# EAGLE design esp32-driver (EAGLE 9.6.2)
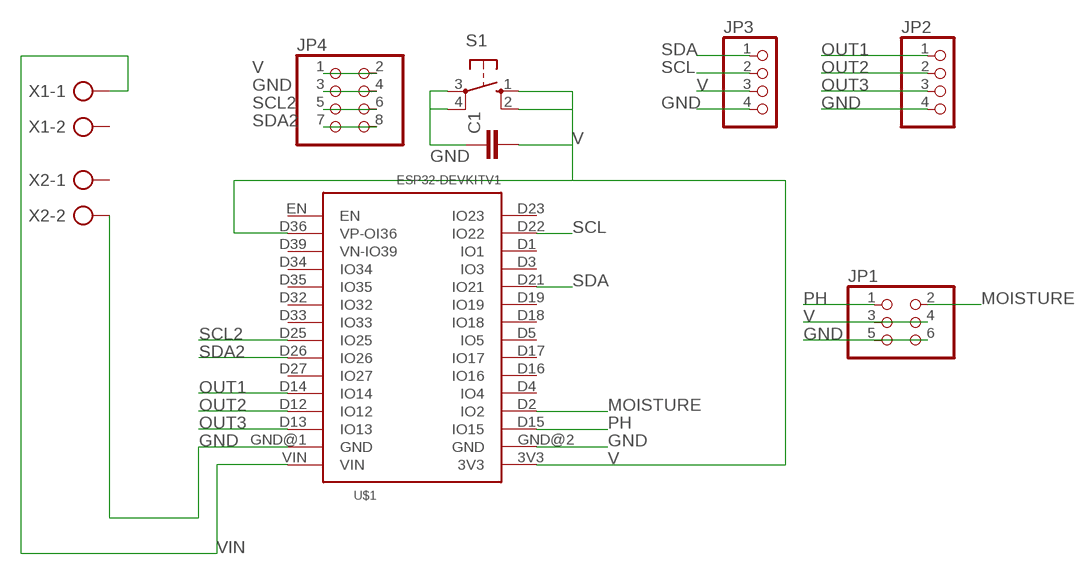
[diagram p0: schematic, sheet 1]

## Parts
C1  C-EU050-030X075  [C050-030X075]
JP1  PINHD-2X3  [2X03]
JP2  PINHD-1X4  [1X04]
JP3  PINHD-1X4  [1X04]
JP4  PINHD-2X4  [2X04]
S1  10-XX  [B3F-10XX]
U$1  ESP32DEVKITV1  [ESP32-DEVKITV1]
X1  AK300/2  [AK300/2]
X2  AK300/2  [AK300/2]

## Nets
GND: C1.1 JP1.5 JP1.6 JP2.4 JP3.4 JP4.3 JP4.4 S1.3(P) S1.4(P1) U$1.GND@1(GND) U$1.GND@2(GND) X2.2
MOISTURE: JP1.2 U$1.D2(IO2)
OUT1: JP2.1 U$1.D14(IO14)
OUT2: JP2.2 U$1.D12(IO12)
OUT3: JP2.3 U$1.D13(IO13)
PH: JP1.1 U$1.D15(IO15)
SCL: JP3.2 U$1.D22(IO22)
SCL2: JP4.5 JP4.6 U$1.D25(IO25)
SDA: JP3.1 U$1.D21(IO21)
SDA2: JP4.7 JP4.8 U$1.D26(IO26)
V: C1.2 JP1.3 JP1.4 JP3.3 JP4.1 JP4.2 S1.1(S) S1.2(S1) U$1.3V3 U$1.D36(VP-OI36)
VIN: U$1.VIN X1.1
Unconnected: U$1.D1(IO1) U$1.D3(IO3) U$1.D4(IO4) U$1.D5(IO5) U$1.D16(IO16) U$1.D17(IO17) U$1.D18(IO18) U$1.D19(IO19) U$1.D23(IO23) U$1.D27(IO27) U$1.D32(IO32) U$1.D33(IO33) U$1.D34(IO34) U$1.D35(IO35) U$1.D39(VN-IO39) U$1.EN X1.2 X2.1

## Library data of the parts
C1 = rcl:C-EU: CAPACITOR, European symbol; SPICEPREFIX: C
JP1 = pinhead:PINHD-2X3: PIN HEADER
JP2 JP3 = pinhead:PINHD-1X4: PIN HEADER
JP4 = pinhead:PINHD-2X4: PIN HEADER
S1 = switch-omron:10-XX: OMRON SWITCH; MPN: B3F-1000; OC_FARNELL: 176432; OC_NEWARK: 36M3542
U$1 = esp32-devkitv1:ESP32DEVKITV1
X1 X2 = con-ptr500:AK300/2: CONNECTOR; OC_FARNELL: unknown; OC_NEWARK: unknown

## Board
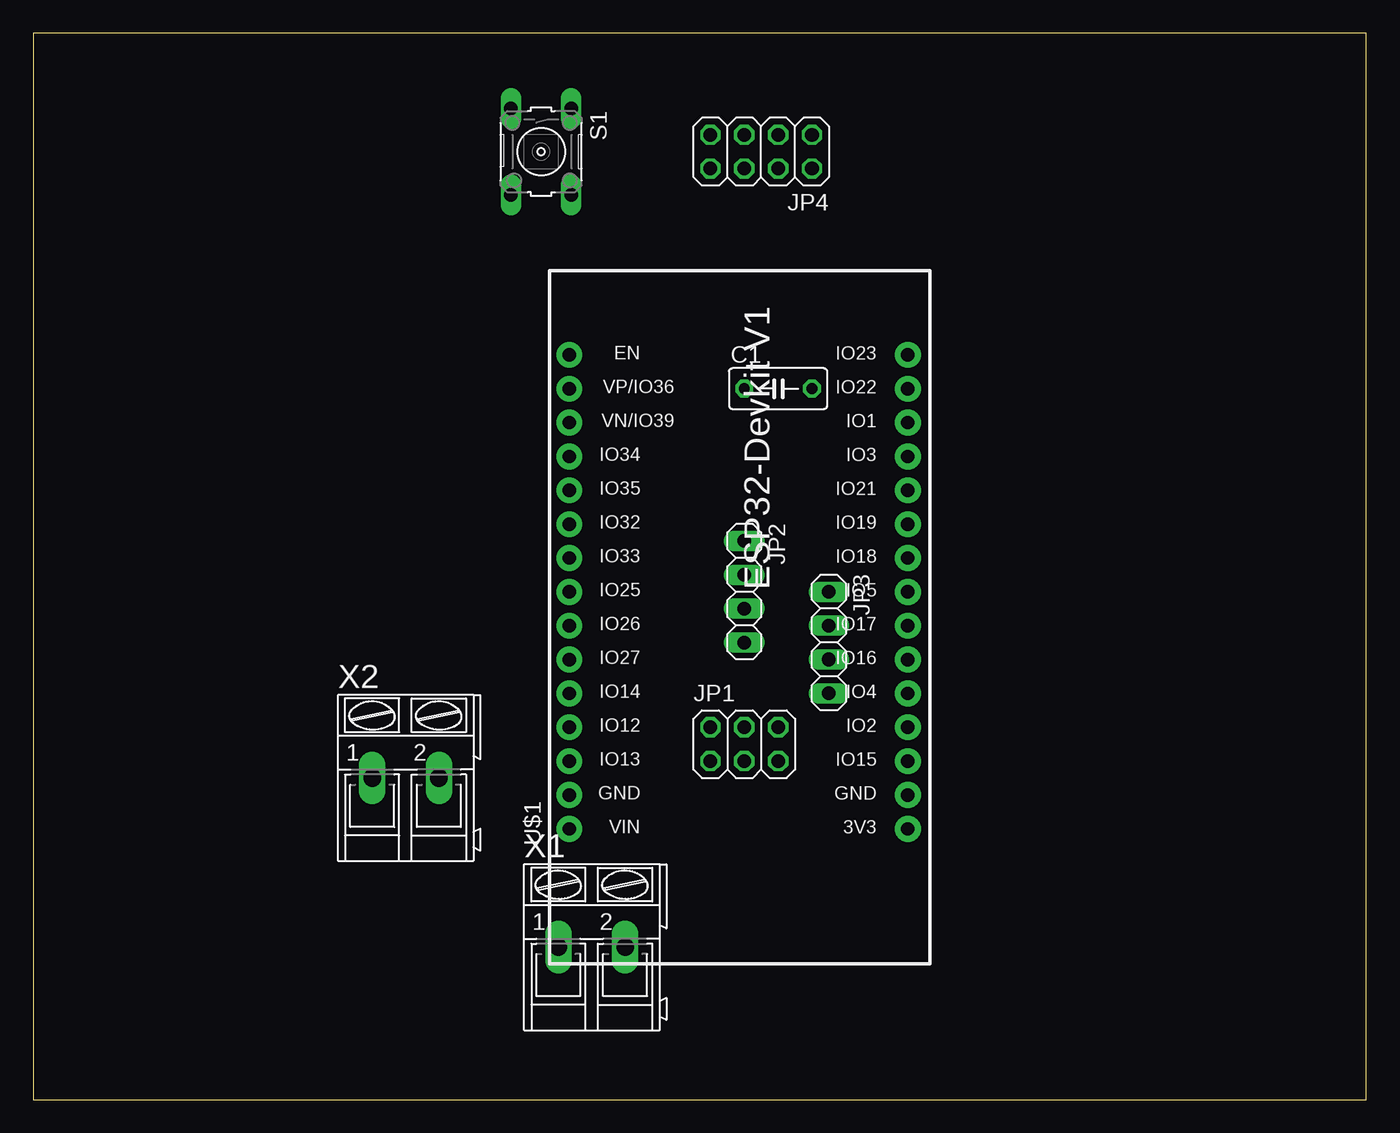
[diagram p1: board, top side]
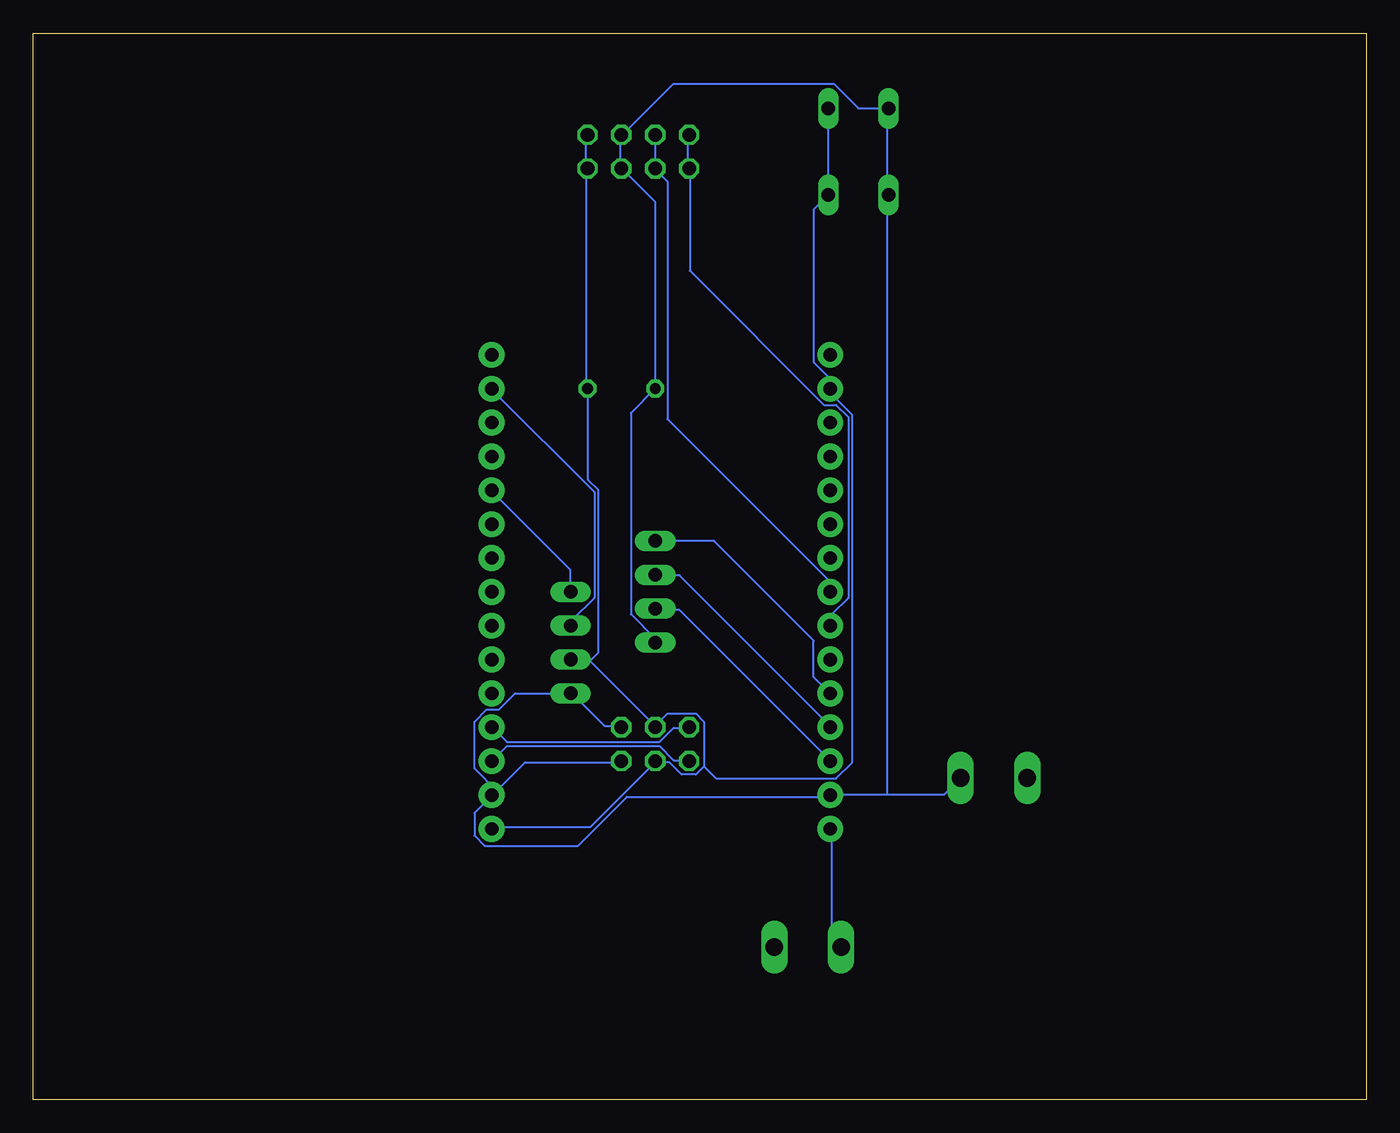
[diagram p2: board, bottom side, seen from below]

Size 100 x 80 mm. Coordinates in mm from the lower left corner, seen from the top.
Outline: 0,0 100,0 100,80 0,80 0,0
Copper layers (1*16): Top 0.035mm / dielectric 1.5mm / Bottom 0.035mm
Design rules "default": minimum track width 6mil, minimum drill 0.35mm, track to track 6mil, track to pad 6mil, pad to pad 6mil, via to via 6mil, smd to smd 6mil, copper to edge 40mil, drill to drill 6mil, minimum pad ring 10mil, minimum via ring 8mil, stop-mask expansion 4mil, vias tented up to drill 0mil, thermal gap 10mil

### Footprints (pad centres in the part's own frame; a part is rotated, then mirrored left to right if it is on the bottom)
C050-030X075 = drill 0.813 octagon: 1 -2.54,0; 2 2.54,0
2X03 = drill 1.016 octagon: 1 -2.54,-1.27; 2 -2.54,1.27; 3 0,-1.27; 4 0,1.27; 5 2.54,-1.27; 6 2.54,1.27
1X04 = drill 1.016 long: 1 -3.81,0; 2 -1.27,0; 3 1.27,0; 4 3.81,0
2X04 = drill 1.016 octagon: 1 -3.81,-1.27; 2 -3.81,1.27; 3 -1.27,-1.27; 4 -1.27,1.27; 5 1.27,-1.27; 6 1.27,1.27; 7 3.81,-1.27; 8 3.81,1.27
B3F-10XX = drill 1.016 long: 1 -3.251,2.261; 2 3.251,2.261; 3 -3.251,-2.261; 4 3.251,-2.261
ESP32-DEVKITV1 = drill 1 pad 1.93: 3V3 -16.52,-12.27; D1 13.96,-12.27; D2 -8.9,-12.27; D3 11.42,-12.27; D4 -6.36,-12.27; D5 1.26,-12.27; D12 -8.9,13.135; D13 -11.44,13.135; D14 -6.36,13.135; D15 -11.44,-12.27; D16 -3.82,-12.27; D17 -1.28,-12.27; D18 3.8,-12.27; D19 6.34,-12.27; D21 8.88,-12.27; D22 16.5,-12.27; D23 19.04,-12.27; D25 1.26,13.135; D26 -1.28,13.135; D27 -3.82,13.135; D32 6.34,13.135; D33 3.8,13.135; D34 11.42,13.135; D35 8.88,13.135; D36 16.5,13.135; D39 13.96,13.135; EN 19.04,13.135; GND@1 -13.98,13.135; GND@2 -13.98,-12.27; VIN -16.52,13.135
AK300/2 = drill 1.321 long: 1 -2.515,0; 2 2.489,0

### Placement (x,y rotation side)
C1  55.88,53.34 0 top
JP1  53.34,26.67 0 top
JP2  53.34,38.1 270 top
JP3  59.69,34.29 270 top
JP4  54.61,71.12 180 top
S1  38.1,71.12 270 top
U$1  53.34,36.83 90 top
X1  41.91,11.43 0 top
X2  27.94,24.13 0 top

### Tracks (layer width: path | path; a pad name or v marks a point on that pad's centre or on a via)
GND
  Bottom 0.152: 35.97,22.86 31.7,22.86 X2.2 | 35.97,22.86 40.08,22.86 U$1.GND@1 40.23,22.71 55.47,22.71 59.13,19.05 66.14,19.05 66.9,19.81 66.9,21.49 65.68,22.71 U$1.GND@2 | JP1.6 55.93,28.04 57.15,28.04 59.59,30.48 JP3.4 63.86,30.48 65.08,29.26 65.99,29.26 66.9,28.35 66.9,24.84 65.23,23.16 | 65.23,23.16 65.53,22.86 U$1.GND@2 | 65.23,23.16 63.09,25.3 55.93,25.3 JP1.5 | 65.23,23.16 U$1.GND@2 | 35.97,74.37 35.97,67.97 S1.4 35.97,67.82 35.97,22.86 | JP2.4 53.34,34.59 55.17,36.42 55.17,51.51 C1.1 53.34,67.36 55.78,69.8 JP4.4 55.93,69.95 55.93,72.39 JP4.3 55.78,72.39 51.97,76.2 39.93,76.2 38.1,74.37 35.97,74.37 | 35.97,74.37 S1.3
MOISTURE
  Bottom 0.152: JP1.2 50.9,27.89 51.97,27.89 53.03,26.82 64.47,26.82 65.53,27.89 U$1.D2
OUT1
  Bottom 0.152: JP2.1 48.92,41.91 41.45,34.44 41.45,31.7 40.23,30.48 U$1.D14
OUT2
  Bottom 0.152: JP2.2 53.34,39.32 51.51,39.32 40.23,28.04 U$1.D12
OUT3
  Bottom 0.152: JP2.3 53.34,36.73 51.51,36.73 40.23,25.45 U$1.D13
PH
  Bottom 0.152: JP1.1 50.9,25.45 51.97,25.45 53.03,26.52 64.47,26.52 65.53,25.45 U$1.D15
SCL
  Bottom 0.152: JP3.2 59.59,35.66 59.59,35.97 57.91,37.64 57.91,45.57 65.53,53.19 U$1.D22
SCL2
  Bottom 0.152: JP4.5 JP4.6 53.34,69.8 52.43,68.89 52.43,51.05 40.23,38.86 40.23,38.1 U$1.D25
SDA
  Bottom 0.152: JP3.1 59.74,38.1 59.74,39.78 65.53,45.57 U$1.D21
SDA2
  Bottom 0.152: JP4.7 50.9,72.39 50.9,69.95 JP4.8 50.75,69.8 50.75,62.18 40.69,52.12 39.78,52.12 38.86,51.21 38.86,37.64 40.08,36.42 40.08,35.66 U$1.D26
V
  Bottom 0.152: S1.1 40.39,74.37 40.39,67.97 S1.2 40.39,67.82 41.45,66.75 41.45,55.32 40.23,54.1 40.23,53.34 U$1.D36 40.08,53.19 40.08,52.88 38.56,51.36 38.56,25.3 39.78,24.08 48.77,24.08 49.68,24.99 | JP4.1 58.52,72.39 58.52,69.95 JP4.2 58.52,69.8 58.52,53.34 C1.2 58.37,53.34 58.37,46.48 57.61,45.72 57.61,33.53 58.22,32.92 | 53.34,25.3 52.27,25.3 51.36,24.38 50.29,24.38 49.68,24.99 | 49.68,24.99 49.68,28.35 50.29,28.96 52.43,28.96 53.34,28.04 | 58.22,32.92 59.59,32.92 JP3.3 58.22,32.92 | 53.34,28.04 58.22,32.92 | 53.34,28.04 JP1.4 | 53.34,25.3 58.22,20.42 65.53,20.42 U$1.3V3 | 53.34,25.3 JP1.3
VIN
  Bottom 0.152: U$1.VIN 40.08,20.27 40.08,12.04 39.47,11.43 X1.1